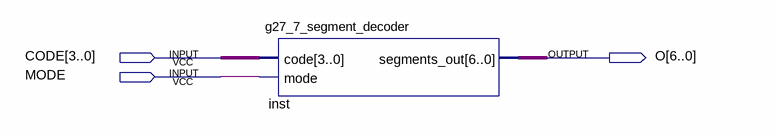
[diagram p0: schematic sheet]
// Quartus schematic g27_7_segment_decoder_Schematic.bdf as structural Verilog: 1 symbols, 3 pins
module g27_7_segment_decoder_Schematic (
  input  [3:0] CODE,
  input  MODE,
  output [6:0] O
);

  g27_7_segment_decoder inst (.code(CODE), .mode(MODE), .segments_out(O));
endmodule
